# Altium schematic sheet Schematic.schdoc
size 307 x 218 mm; Symbol: Drawing-Symbol_A4; Device: Drawing-Symbol_A4; Company: 嘉立创EDA; Version: V1.0; Page Size: A4; @Project Name: 一种小巧车载实时加速度显示器; @Page Count: 1; @Update Date: 2025-10-13; @Create Date: 2025-09-15; @Schematic Name: Schematic1; @Page No: 1; @Page Name: P1; @Create Time: 08:38:36; @Update Time: 17:02:05; Width: 1170; Height: 825; Region Start: 1; X Region Count: 6; Y Region Count: 4; Blade Width: 10; Title Block Position: 3; @Board Name: Board1
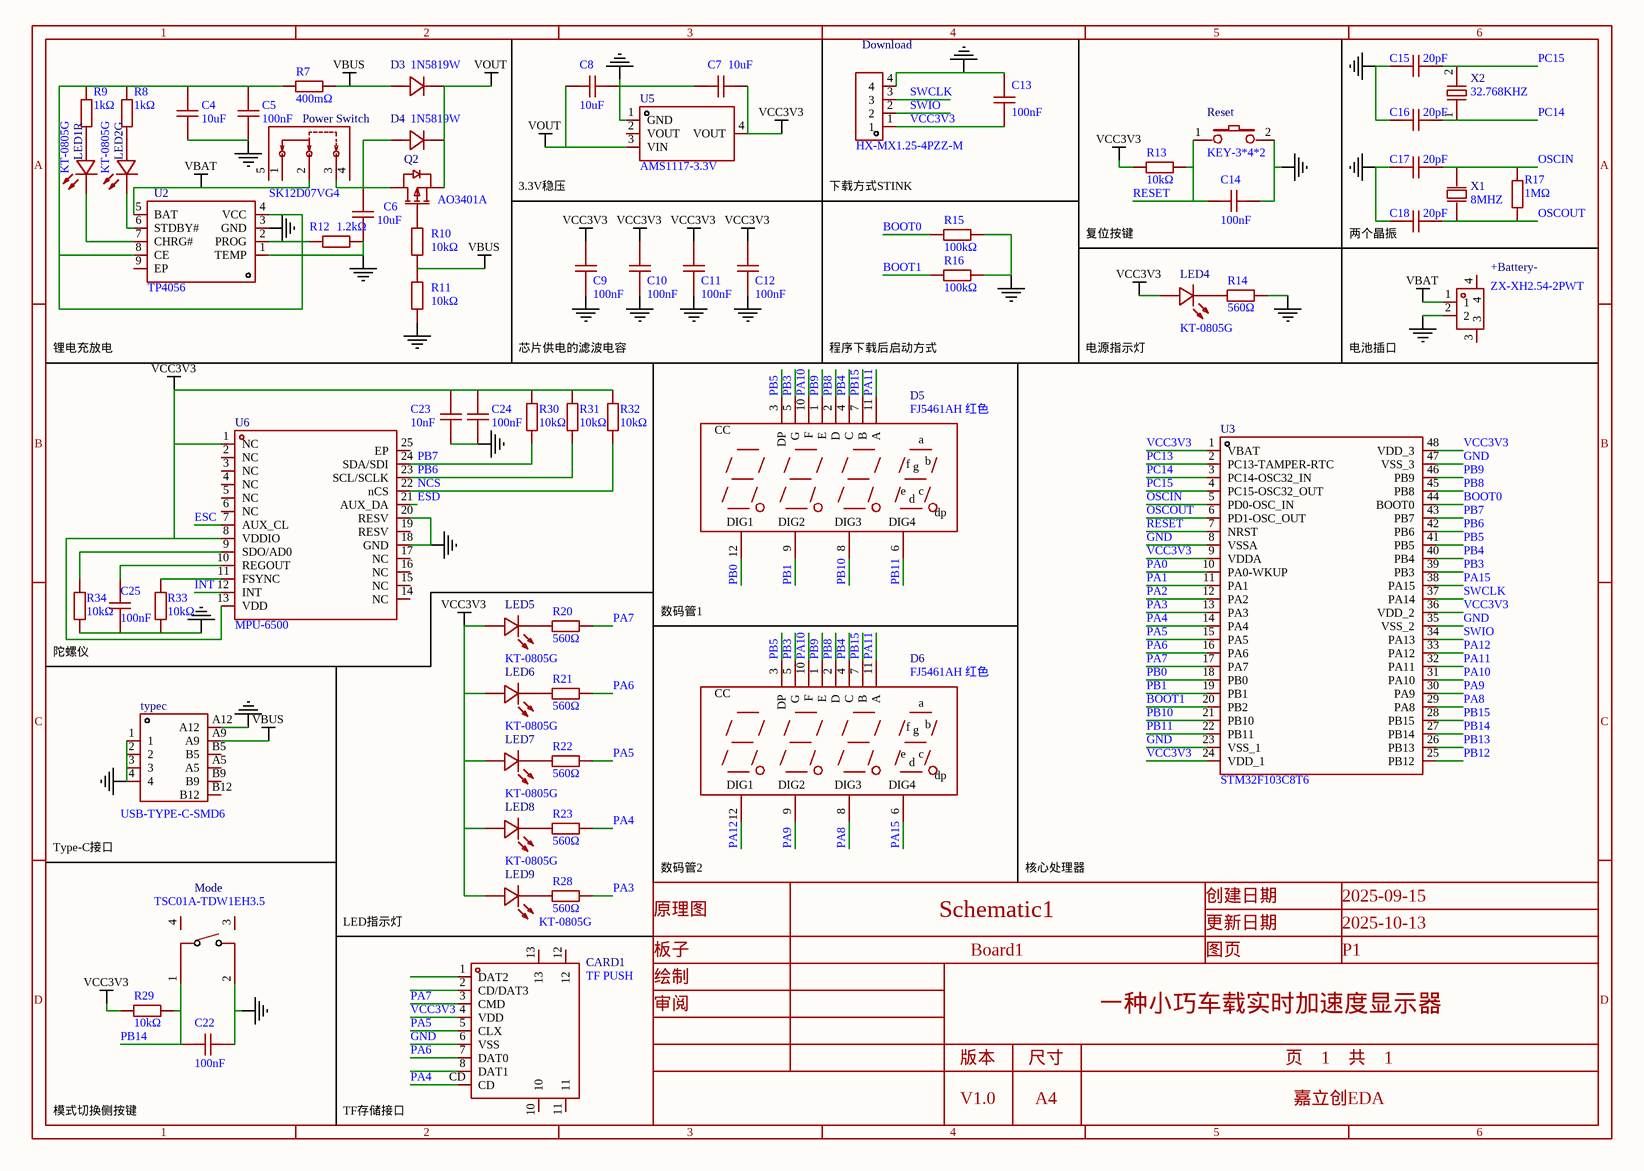
[diagram p0: Schematic.schdoc]

## Parts
+Battery-  ZX-XH2.54-2PWT  [CONN-SMD_2P-P2.54_MEGASTAR_ZX-XH2.54-2PWT]
C4  10uF  [C0603]
C5  100nF  [C0603]
C6  10uF  [C0603]
C7  10uF  [C0603]
C8  10uF  [C0603]
C9  100nF  [C0603]
C10  100nF  [C0603]
C11  100nF  [C0603]
C12  100nF  [C0603]
C13  100nF  [C0603]
C14  100nF  [C0603]
C15  20pF  [C0603]
C16  20pF  [C0603]
C17  20pF  [C0603]
C18  20pF  [C0603]
C22  100nF  [C0603]
C23  10nF  [C0603]
C24  100nF  [C0603]
C25  100nF  [C0603]
CARD1  TF PUSH  [TF-SMD_TF-PUSH]
D3  1N5819W  [SOD-123_L2.7-W1.6-LS3.7-RD]
D4  1N5819W  [SOD-123_L2.7-W1.6-LS3.7-RD]
D5  FJ5461AH 红色  [LED-SEG-TH_FJ5461AH]
D6  FJ5461AH 红色  [LED-SEG-TH_FJ5461AH]
Download  HX-MX1.25-4PZZ-M  [CONN-TH_4P-P1.25_HX-1.25MM-4P-ZZ-MS]
LED1R  KT-0805G  [LED0805-R-RD]
LED2G  KT-0805G  [LED0805-R-RD]
LED4  KT-0805G  [LED0805-R-RD]
LED5  KT-0805G  [LED0805-R-RD]
LED6  KT-0805G  [LED0805-R-RD]
LED7  KT-0805G  [LED0805-R-RD]
LED8  KT-0805G  [LED0805-R-RD]
LED9  KT-0805G  [LED0805-R-RD]
Mode  TSC01A-TDW1EH3.5  [KEY-SMD_4P-L4.6-W2.4_TSC01A-TDW1FH3.5]
Power_Switch  SK12D07VG4  [SW-TH_SK12D07VG4]
Q2  AO3401A  [SOT-23_L2.9-W1.3-P1.90-LS2.4-BR]
R7  400mΩ  [R0603]
R8  1kΩ  [R0603]
R9  1kΩ  [R0603]
R10  10kΩ  [R0603]
R11  10kΩ  [R0603]
R12  1.2kΩ  [R0603]
R13  10kΩ  [R0603]
R14  560Ω  [R0603]
R15  100kΩ  [R0603]
R16  100kΩ  [R0603]
R17  1MΩ  [R0603]
R20  560Ω  [R0603]
R21  560Ω  [R0603]
R22  560Ω  [R0603]
R23  560Ω  [R0603]
R28  560Ω  [R0603]
R29  10kΩ  [R0603]
R30  10kΩ  [R0603]
R31  10kΩ  [R0603]
R32  10kΩ  [R0603]
R33  10kΩ  [R0603]
R34  10kΩ  [R0603]
Reset  KEY-3*4*2  [SW-SMD_L4.0-W2.9-LS5.0]
typec  USB-TYPE-C-SMD6  [MICRO-USB-SMD_USB-TYPE-C-SMD6]
U2  TP4056  [ESOP-8_L4.9-W3.9-P1.27-LS6.0-BL-EP]
U3  STM32F103C8T6  [LQFP-48_L7.0-W7.0-P0.50-LS9.0-BL]
U5  AMS1117-3.3V  [SOT-223-3_L6.5-W3.4-P2.30-LS7.0-BR]
U6  MPU-6500  [QFN-24_L3.0-W3.0-P0.40-BL-EP]
X1  8MHZ  [HC-49S_L11.5-W5.0-P4.88]
X2  32.768KHZ  [CRYSTAL-SMD_L3.2-W1.5-1]

## Nets
GND: +Battery-.2 C4.1 C5.1 C6.1 C7.1 C8.2 C9.1 C10.1 C11.1 C12.1 C13.2 C14.2 C15.1 C16.1 C17.1 C18.1 C22.2 C23.1 C24.1 C25.1 CARD1.6(VSS) Download.4 Mode.2 R11.1 R12.2 R14.2 R15.2 R16.2 R33.1 R34.1 Reset.2 typec.1 typec.2 typec.3 typec.4 typec.A12 U2.1(TEMP) U2.3(GND) U3.8(VSSA) U3.23(VSS_1) U3.35(VSS_2) U3.47(VSS_3) U5.1(GND) U6.18(GND) U6.20(RESV)
VBAT: +Battery-.1 Power_Switch.2 U2.5(BAT)
VBUS: D3.2(A) R7.2 R10.1 R11.2 typec.A9
VCC3V3: C7.2 C9.2 C10.2 C11.2 C12.2 C13.1 C23.2 C24.2 CARD1.4(VDD) Download.1 LED4.1(A) LED5.1(A) LED6.1(A) LED7.1(A) LED8.1(A) LED9.1(A) R13.1 R29.1 R30.2 R31.2 R32.2 U3.1(VBAT) U3.9(VDDA) U3.24(VDD_1) U3.36(VDD_2) U3.48(VDD_3) U5.4(VOUT) U6.1(NC) U6.8(VDDIO) U6.13(VDD)
VOUT: C8.1 D3.1(K) D4.1(K) Q2.2(S) U5.3(VIN)
BOOT0: R15.1 U3.44(BOOT0)
BOOT1: R16.1 U3.20(PB2)
ESC: U6.7(AUX_CL)
ESD: U6.21(AUX_DA)
INT: U6.12(INT)
NCS: R32.1 U6.22(nCS)
OSCIN: C17.2 R17.2 U3.5(PD0-OSC_IN) X1.2(OSC2)
OSCOUT: C18.2 R17.1 U3.6(PD1-OSC_OUT) X1.1(OSC1)
PA0: U3.10(PA0-WKUP)
PA1: U3.11(PA1)
PA2: U3.12(PA2)
PA3: R28.2 U3.13(PA3)
PA4: CARD1.CD R23.2 U3.14(PA4)
PA5: CARD1.5(CLX) R22.2 U3.15(PA5)
PA6: CARD1.7(DAT0) R21.2 U3.16(PA6)
PA7: CARD1.3(CMD) R20.2 U3.17(PA7)
PA8: D6.8(DIG3) U3.29(PA8)
PA9: D6.9(DIG2) U3.30(PA9)
PA10: D5.10(F) D6.10(F) U3.31(PA10)
PA11: D5.11(A) D6.11(A) U3.32(PA11)
PA12: D6.12(DIG1) U3.33(PA12)
PA15: D6.6(DIG4) U3.38(PA15)
PB0: D5.12(DIG1) U3.18(PB0)
PB1: D5.9(DIG2) U3.19(PB1)
PB3: D5.5(G) D6.5(G) U3.39(PB3)
PB4: D5.4(C) D6.4(C) U3.40(PB4)
PB5: D5.3(DP) D6.3(DP) U3.41(PB5)
PB6: R31.1 U3.42(PB6) U6.23(SCL/SCLK)
PB7: R30.1 U3.43(PB7) U6.24(SDA/SDI)
PB8: D5.2(D) D6.2(D) U3.45(PB8)
PB9: D5.1(E) D6.1(E) U3.46(PB9)
PB10: D5.8(DIG3) U3.21(PB10)
PB11: D5.6(DIG4) U3.22(PB11)
PB12: U3.25(PB12)
PB13: U3.26(PB13)
PB14: C22.1 Mode.1 R29.2 U3.27(PB14)
PB15: D5.7(B) D6.7(B) U3.28(PB15)
PC13: U3.2(PC13-TAMPER-RTC)
PC14: C16.2 U3.3(PC14-OSC32_IN) X2.1
PC15: C15.2 U3.4(PC15-OSC32_OUT) X2.2
RESET: C14.1 R13.2 Reset.1 U3.7(NRST)
SWCLK: Download.3 U3.37(PA14)
SWIO: Download.2 U3.34(PA13)
NetC4_2: C4.2 C5.2 R7.1 R8.2 R9.2 U2.4(VCC) U2.8(CE)
NetC6_2: C6.2 D4.2(A) Power_Switch.3 Q2.3(D)
NetC25_2: C25.2 U6.10(REGOUT)
NetLED1R_1: LED1R.1(A) R9.1
NetLED1R_2: LED1R.2(K) U2.7(CHRG#)
NetLED2G_1: LED2G.1(A) R8.1
NetLED2G_2: LED2G.2(K) U2.6(STDBY#)
NetLED4_2: LED4.2(K) R14.1
NetLED5_2: LED5.2(K) R20.1
NetLED6_2: LED6.2(K) R21.1
NetLED7_2: LED7.2(K) R22.1
NetLED8_2: LED8.2(K) R23.1
NetLED9_2: LED9.2(K) R28.1
NetQ2_1: Q2.1(G) R10.2
NetR12_1: R12.1 U2.2(PROG)
NetR33_2: R33.2 U6.11(FSYNC)
NetR34_2: R34.2 U6.9(SDO/AD0)

Not connected (* = marked no-connect by the designer): +Battery- 3 4; CARD1 1(DAT2) 2(CD/DAT3) 8(DAT1) 10 11 12 13; Mode 3 4; Power_Switch 1 4 5; typec A5 B5 B9 B12; U2 9(EP); U5 2(VOUT); U6 2(NC) 3(NC) 4(NC) 5(NC) 6(NC) 14(NC) 15(NC) 16(NC) 17(NC) 19(RESV) 25(EP)

## Notes on the sheet
- 3.3V稳压
- 下载方式STINK
- 复位按键
- (near C18) 两个晶振
- 锂电充放电
- 芯片供电的滤波电容
- 程序下载后启动方式
- 电源指示灯
- 电池插口
- (near R34) 陀螺仪
- 数码管1
- Type-C接口
- LED指示灯
- 数码管2
- 核心处理器
- 模式切换侧按键
- TF存储接口
- 1
- 2
- 3
- 4
- 5
- 6
- A
- B
- C
- 原理图
- Schematic1
- 创建日期
- 更新日期
- 2025-09-15
- 2025-10-13
- 板子
- 绘制
- Board1
- 图页
- P1
- D
- 审阅
- 版本
- 尺寸
- 一种小巧车载实时加速度显示器
- 页    1    共    1
- V1.0
- A4
- 嘉立创EDA
- (in symbol FJ5461AH 红色) CC; a; f; b; g; e; c; d; dp

## Library data of the parts
+Battery- = ZX-XH2.54-2PWT: Manufacturer: Megastar(兆星); Add into BOM: yes; Pins Structure: 1x2P; Pitch: 2.5mm; Reference Series: XH; Number of PINs Per Row: 2; Current Rating: 3A; Voltage Rating: 250V; Supplementary Features: 辅助焊脚; Z-Height of the Board: 6.2mm; X-Length of Bottom Edge on Board (Spacing Line): 10mm; Y-Width of Bottom Edge on Board: 10.5mm; Symbol: ZX-XH2.54-2PWT; Device: ZX-XH2.54-2PWT; LCSC Part Name: 1x2P 间距:2.5mm 卧贴 系列:XH; Supplier Part: C7429671; Manufacturer Part: ZX-XH2.54-2PWT; Supplier Footprint: SMD,P=2.5mm,卧贴; JLCPCB Part Class: 扩展库; Datasheet: https://item.szlcsc.com/datasheet/ZX-XH2.54-2PWT/8427588.html; Supplier: LCSC; Convert to PCB: yes; Mounting Type: 卧贴; Number of Pins: 2P; Number of Rows: 1; Row Spacing: -; Contact Material: 黄铜; Contact Plating: 锡; Operating Temperature: -25℃~+85℃; Plastic Material: -; Flame Retardant Rating: -; Color: 米色
C4 = CGA0603X5R106K100JT: Manufacturer: HRE(芯声); Symbol: Capacitance; Add into BOM: yes; Tolerance: ±10%; Voltage Rating: 10V; Temperature Coefficient: X5R; Channel ID: $1e1874; Device: CGA0603X5R106K100JT; LCSC Part Name: 10uF ±10% 10V; Supplier Part: C6119842; Manufacturer Part: CGA0603X5R106K100JT; Supplier Footprint: 0603; JLCPCB Part Class: Extended Part; Supplier: LCSC; Convert to PCB: yes; Value: 10uF; FootprintName: C0603; DeviceName: CGA0603X5R106K100JT
C5 C9-C14 C22 C24 C25 = CGA0603X7R104K500JT: Manufacturer: HRE(芯声); Symbol: Capacitance; Add into BOM: yes; Tolerance: ±10%; Voltage Rating: 50V; Temperature Coefficient: X7R; Device: CGA0603X7R104K500JT; LCSC Part Name: 100nF ±10% 50V; Supplier Part: C6119867; Manufacturer Part: CGA0603X7R104K500JT; Supplier Footprint: 0603; JLCPCB Part Class: Extended Part; Datasheet: https://atta.szlcsc.com/upload/public/pdf/source/20250103/C44077DA9E7B3EFAE02F22B6D3D1CBC9.pdf; Supplier: LCSC; Convert to PCB: yes; Value: 100nF
C6 = CGA0603X5R106K100JT: Manufacturer: HRE(芯声); Symbol: Capacitance; Add into BOM: yes; Tolerance: ±10%; Voltage Rating: 10V; Temperature Coefficient: X5R; Channel ID: $1e1609; Device: CGA0603X5R106K100JT; LCSC Part Name: 10uF ±10% 10V; Supplier Part: C6119842; Manufacturer Part: CGA0603X5R106K100JT; Supplier Footprint: 0603; JLCPCB Part Class: Extended Part; Supplier: LCSC; Convert to PCB: yes; Value: 10uF; FootprintName: C0603; DeviceName: CGA0603X5R106K100JT
C7 = CGA0603X5R106K100JT: Manufacturer: HRE(芯声); Symbol: Capacitance; Add into BOM: yes; Tolerance: ±10%; Voltage Rating: 10V; Temperature Coefficient: X5R; Channel ID: $1e4183; Device: CGA0603X5R106K100JT; LCSC Part Name: 10uF ±10% 10V; Supplier Part: C6119842; Manufacturer Part: CGA0603X5R106K100JT; Supplier Footprint: 0603; JLCPCB Part Class: Extended Part; Supplier: LCSC; Convert to PCB: yes; Value: 10uF; FootprintName: C0603; DeviceName: CGA0603X5R106K100JT
C8 = CGA0603X5R106K100JT: Manufacturer: HRE(芯声); Symbol: Capacitance; Add into BOM: yes; Tolerance: ±10%; Voltage Rating: 10V; Temperature Coefficient: X5R; Channel ID: $1e4207; Device: CGA0603X5R106K100JT; LCSC Part Name: 10uF ±10% 10V; Supplier Part: C6119842; Manufacturer Part: CGA0603X5R106K100JT; Supplier Footprint: 0603; JLCPCB Part Class: Extended Part; Supplier: LCSC; Convert to PCB: yes; Value: 10uF; FootprintName: C0603; DeviceName: CGA0603X5R106K100JT
C15 = CC0603JRNPO9BN200: Manufacturer: YAGEO(国巨); Symbol: Capacitance; Add into BOM: yes; Tolerance: ±5%; Voltage Rated: 50V; Temperature Coefficient: NP0; Channel ID: $1e6253; Device: CC0603JRNPO9BN200; LCSC Part Name: 20pF ±5% 50V; Supplier Part: C105621; Manufacturer Part: CC0603JRNPO9BN200; Supplier Footprint: 0603; JLCPCB Part Class: Extended Part; Datasheet: https://atta.szlcsc.com/upload/public/pdf/source/20170505/1493957838062.pdf; Supplier: LCSC; Convert to PCB: yes; Value: 20pF; FootprintName: C0603; DeviceName: CC0603JRNPO9BN200
C16 = CC0603JRNPO9BN200: Manufacturer: YAGEO(国巨); Symbol: Capacitance; Add into BOM: yes; Tolerance: ±5%; Voltage Rated: 50V; Temperature Coefficient: NP0; Channel ID: $1e6277; Device: CC0603JRNPO9BN200; LCSC Part Name: 20pF ±5% 50V; Supplier Part: C105621; Manufacturer Part: CC0603JRNPO9BN200; Supplier Footprint: 0603; JLCPCB Part Class: Extended Part; Datasheet: https://atta.szlcsc.com/upload/public/pdf/source/20170505/1493957838062.pdf; Supplier: LCSC; Convert to PCB: yes; Value: 20pF; FootprintName: C0603; DeviceName: CC0603JRNPO9BN200
C17 = CC0603JRNPO9BN200: Manufacturer: YAGEO(国巨); Symbol: Capacitance; Add into BOM: yes; Tolerance: ±5%; Voltage Rated: 50V; Temperature Coefficient: NP0; Channel ID: $1e6574; Device: CC0603JRNPO9BN200; LCSC Part Name: 20pF ±5% 50V; Supplier Part: C105621; Manufacturer Part: CC0603JRNPO9BN200; Supplier Footprint: 0603; JLCPCB Part Class: Extended Part; Datasheet: https://atta.szlcsc.com/upload/public/pdf/source/20170505/1493957838062.pdf; Supplier: LCSC; Convert to PCB: yes; Value: 20pF; FootprintName: C0603; DeviceName: CC0603JRNPO9BN200
C18 = CC0603JRNPO9BN200: Manufacturer: YAGEO(国巨); Symbol: Capacitance; Add into BOM: yes; Tolerance: ±5%; Voltage Rated: 50V; Temperature Coefficient: NP0; Channel ID: $1e6628; Device: CC0603JRNPO9BN200; LCSC Part Name: 20pF ±5% 50V; Supplier Part: C105621; Manufacturer Part: CC0603JRNPO9BN200; Supplier Footprint: 0603; JLCPCB Part Class: Extended Part; Datasheet: https://atta.szlcsc.com/upload/public/pdf/source/20170505/1493957838062.pdf; Supplier: LCSC; Convert to PCB: yes; Value: 20pF; FootprintName: C0603; DeviceName: CC0603JRNPO9BN200
C23 = CGA0603X7R103K500JT: Manufacturer: HRE(芯声); Symbol: Capacitance; Add into BOM: yes; Tolerance: ±10%; Voltage Rating: 50V; Temperature Coefficient: X7R; Channel ID: $1e29061; Device: CGA0603X7R103K500JT; LCSC Part Name: 10nF ±10% 50V; Supplier Part: C7503504; Manufacturer Part: CGA0603X7R103K500JT; Supplier Footprint: 0603; JLCPCB Part Class: Extended Part; Supplier: LCSC; Convert to PCB: yes; Value: 10nF; FootprintName: C0603; DeviceName: CGA0603X7R103K500JT
CARD1 = TF PUSH: Manufacturer: SHOU HAN(首韩); Add into BOM: yes; Card Connection Mode: 自弹式; Card Type: MicroSD卡(TF卡); Connector Type: 卡座; Additional Card Detection Pins: 无; Symbol: TF PUSH; Device: TF PUSH; LCSC Part Name: 自弹式 MicroSD卡(TF卡) 卡座; Supplier Part: C393941; Manufacturer Part: TF PUSH; Supplier Footprint: SMD; JLCPCB Part Class: 扩展库; Datasheet: https://item.szlcsc.com/datasheet/TF%2520PUSH/372553.html; Supplier: LCSC; Convert to PCB: yes; Supplementary Features: -; Height Above Board: 2mm; Operating Temperature: -25℃~+90℃
D3 = 1N5819W_C5451628: Manufacturer: HXY MOSFET(华轩阳电子); Symbol: 1N4007_C9900004759; Add into BOM: yes; Diode Configuration: 独立式; Voltage - Forward(Vf@If): 600mV@200mA; Voltage - DC Reverse(Vr): 40V; Current - Rectified: 350mA; Reverse Leakage Current (Ir): 5uA@30V; Channel ID: $1e1657; Device: 1N5819W_C5451628; LCSC Part Name: 电压:40V 电流:350mA; Supplier Part: C5451628; Manufacturer Part: 1N5819W; Supplier Footprint: SOD-123; JLCPCB Part Class: Extended Part; Datasheet: https://item.szlcsc.com/datasheet/1N5819W/6355371.html; Supplier: LCSC; Convert to PCB: yes; FootprintName: SOD-123_L2.7-W1.6-LS3.7-RD; DeviceName: 1N5819W_C5451628
D4 = 1N5819W_C5451628: Manufacturer: HXY MOSFET(华轩阳电子); Symbol: 1N4007_C9900004759; Add into BOM: yes; Diode Configuration: 独立式; Voltage - Forward(Vf@If): 600mV@200mA; Voltage - DC Reverse(Vr): 40V; Current - Rectified: 350mA; Reverse Leakage Current (Ir): 5uA@30V; Channel ID: $1e1687; Device: 1N5819W_C5451628; LCSC Part Name: 电压:40V 电流:350mA; Supplier Part: C5451628; Manufacturer Part: 1N5819W; Supplier Footprint: SOD-123; JLCPCB Part Class: Extended Part; Datasheet: https://item.szlcsc.com/datasheet/1N5819W/6355371.html; Supplier: LCSC; Convert to PCB: yes; FootprintName: SOD-123_L2.7-W1.6-LS3.7-RD; DeviceName: 1N5819W_C5451628
D5 D6 = FJ5461AH 红色: Manufacturer: 志浩; Symbol: FJ5461AH red; Add into BOM: yes; Number of Characters: 4位; Display Type: 7段; LED Polarity: 共阴极; Digit/Alpha Size(inch): 0.56; Device: FJ5461AH 红色; LCSC Part Name: 4位0.56英寸红色数码管 共阴极; Supplier Part: C54396; Manufacturer Part: FJ5461AH 红色; Supplier Footprint: 插件; JLCPCB Part Class: 扩展库; Datasheet: https://atta.szlcsc.com/upload/public/pdf/source/20151111/1457707576636.pdf; Supplier: LCSC; Convert to PCB: yes; Module Size: -; Power Dissipation: -; Luminous Color: 红色
Download = HX-MX1.25-4PZZ-M: Manufacturer: hanxia(韩下); Add into BOM: yes; Pins Structure: 1x4P; Pitch: 1.25mm; Number of PINs Per Row: 4; Current Rating: 1A; Voltage Rating: 125V; Plastic Material: PA6T; Flame Retardant Rating: UL94V-0; Symbol: HX-MX1.25-4PZZ-M; Device: HX-MX1.25-4PZZ-M; LCSC Part Name: 1x4P 间距:1.25mm 直插; Supplier Part: C48641609; Manufacturer Part: HX-MX1.25-4PZZ-M; Supplier Footprint: 插件,P=1.25mm; JLCPCB Part Class: 扩展库; Datasheet: https://item.szlcsc.com/datasheet/HX-MX1.25-4PZZ-M/50919855.html; Supplier: LCSC; Convert to PCB: yes; Mounting Type: 直插; Reference Series: -; Number of Pins: 4P; Number of Rows: 1; Row Spacing: -; Contact Material: 黄铜; Contact Plating: 锡; Operating Temperature: -25℃~+85℃; Supplementary Features: -; Color: 米色
LED1R LED2G LED4-LED9 = KT-0805G: Manufacturer: KENTO; Symbol: 0805G (Green); Add into BOM: yes; Illumination Color: 翠绿色; Voltage - Forward(Vf): 2.6V~3.1V; Power(Watts): 100mW; Forward Current: 5mA; Wavelength - Dominant: 513nm~528nm; Peak Wavelength: 525nm; Luminous Intensity: 430mcd; Viewing Angle: 120°; Device: KT-0805G; LCSC Part Name: 0805 翠绿 高亮; Supplier Part: C2297; Manufacturer Part: KT-0805G; Supplier Footprint: 0805; JLCPCB Part Class: 基础库; Datasheet: https://item.szlcsc.com/datasheet/KT-0805G/2670.html; Supplier: LCSC; Convert to PCB: yes; Lamp Holder Type: -; Diode Configuration: -; Lens Color: -; Color Temperature: -; Mounting Style: -; Operating Temperature: -40℃~+85℃
Mode = TSC01A-TDW1EH3.5: Manufacturer: XYECONN(辛译); Add into BOM: yes; Circuit: 单刀单掷; Actuator Style: 矩形按钮; Operating Force: 1.8N; Switch Height: 3.5mm; Contact Current: 50mA; Voltage Rating: 12V; Symbol: TSC01A-TDW1EH3.5; Device: TSC01A-TDW1EH3.5; LCSC Part Name: 2*4*3.5 卧贴 180GF 带定位柱 侧按轻触开关; Supplier Part: C22362980; Manufacturer Part: TSC01A-TDW1EH3.5; Supplier Footprint: SMD-4P,4.8x2mm; JLCPCB Part Class: 扩展库; Datasheet: https://item.szlcsc.com/datasheet/TSC01A-TDW1EH3.5/23811828.html; Supplier: LCSC; Convert to PCB: yes; Mounting Type: 卧贴
Power_Switch = SK12D07VG4: Manufacturer: SHOU HAN(首韩); Add into BOM: yes; Circuit: 单刀双掷; Actuator Style: 矩形柱状; Switch Height: 8.8mm; Current Rating: 500mA; Voltage Rating: 50V; Life: 5千次; Channel ID: $1e20535; Symbol: SK12D07VG4; Device: SK12D07VG4; LCSC Part Name: 3脚2档位 卧插 滑动开关; Supplier Part: C393937; Manufacturer Part: SK12D07VG4; Supplier Footprint: 插件; JLCPCB Part Class: 扩展库; Datasheet: https://item.szlcsc.com/datasheet/SK12D07VG4/372549.html; Supplier: LCSC; Convert to PCB: yes; Termination Style: PC引脚; Mounting Type: -; Operating Temperature: -; Length: 8.7mm; FootprintName: SW-TH_SK12D07VG4; DeviceName: SK12D07VG4
Q2 = AO3401A_C347476: Manufacturer: UMW(友台半导体); Add into BOM: yes; Number: 1个P沟道; Drain to Source Voltage: 30V; Current - Continuous Drain(Id): 4.2A; RDS(on): 50mΩ@10V; Pd - Power Dissipation: 1.4W; Gate Threshold Voltage (Vgs(th)): 1.3V@250uA; Gate Charge(Qg): 9.4nC@4.5V; Input Capacitance(Ciss): 954pF; Reverse Transfer Capacitance (Crss@Vds): 77pF; Type: P沟道; Output Capacitance(Coss): 115pF; Symbol: AO3401A_C347476; Device: AO3401A_C347476; LCSC Part Name: 1个P沟道 耐压:30V 电流:4.2A; Supplier Part: C347476; Manufacturer Part: AO3401A; Supplier Footprint: SOT-23; JLCPCB Part Class: 扩展库; Datasheet: https://item.szlcsc.com/datasheet/AO3401A/324136.html; Supplier: LCSC; Convert to PCB: yes; Operating Temperature: -55℃~+150℃
R7 = FRL0603JR400TS: Manufacturer: FOJAN(富捷); Symbol: 电阻; Add into BOM: yes; Tolerance: ±5%; Power(Watts): 100mW; Voltage-Supply(Max): 100V; Temperature Coefficient: ±300ppm/℃; Channel ID: $1e1550; Device: FRL0603JR400TS; LCSC Part Name: 400mΩ ±5% 100mW 厚膜电阻; Supplier Part: C5126106; Manufacturer Part: FRL0603JR400TS; Supplier Footprint: 0603; JLCPCB Part Class: Extended Part; Supplier: LCSC; Convert to PCB: yes; Type: 厚膜电阻; Value: 400mΩ; Operating Temperature: -55℃~+155℃; FootprintName: R0603; DeviceName: FRL0603JR400TS
R8 = FRC0603F1001TS: Manufacturer: FOJAN(富捷); Symbol: 电阻; Add into BOM: yes; Tolerance: ±1%; Power(Watts): 100mW; Voltage-Supply(Max): 75V; Temperature Coefficient: ±100ppm/℃; Channel ID: $1e1944; Device: FRC0603F1001TS; LCSC Part Name: 1kΩ ±1% 100mW 厚膜电阻; Supplier Part: C2907002; Manufacturer Part: FRC0603F1001TS; Supplier Footprint: 0603; JLCPCB Part Class: Extended Part; Supplier: LCSC; Convert to PCB: yes; Type: 厚膜电阻; Value: 1kΩ; Operating Temperature: -55℃~+155℃; Overload Voltage (Max): 75V; FootprintName: R0603; DeviceName: FRC0603F1001TS
R9 = FRC0603F1001TS: Manufacturer: FOJAN(富捷); Symbol: 电阻; Add into BOM: yes; Tolerance: ±1%; Power(Watts): 100mW; Voltage-Supply(Max): 75V; Temperature Coefficient: ±100ppm/℃; Channel ID: $1e1968; Device: FRC0603F1001TS; LCSC Part Name: 1kΩ ±1% 100mW 厚膜电阻; Supplier Part: C2907002; Manufacturer Part: FRC0603F1001TS; Supplier Footprint: 0603; JLCPCB Part Class: Extended Part; Supplier: LCSC; Convert to PCB: yes; Type: 厚膜电阻; Value: 1kΩ; Operating Temperature: -55℃~+155℃; Overload Voltage (Max): 75V; FootprintName: R0603; DeviceName: FRC0603F1001TS
R10 = RCA0310KJLF: Manufacturer: HKR(香港电阻); Symbol: 电阻; Add into BOM: yes; Tolerance: ±5%; Power(Watts): 100mW; Channel ID: $1e1784; Voltage-Supply(Max): 75V; Temperature Coefficient: ±100ppm/℃; Device: RCA0310KJLF; LCSC Part Name: 10kΩ ±5% 100mW; Supplier Part: C22369937; Manufacturer Part: RCA0310KJLF; Supplier Footprint: 0603; JLCPCB Part Class: Extended Part; Datasheet: https://item.szlcsc.com/datasheet/RCA0310KJLF/23848968.html; Supplier: LCSC; Convert to PCB: yes; Value: 10kΩ; Type: 厚膜电阻; FootprintName: R0603; DeviceName: RCA0310KJLF
R11 = RCA0310KJLF: Manufacturer: HKR(香港电阻); Symbol: 电阻; Add into BOM: yes; Tolerance: ±5%; Power(Watts): 100mW; Channel ID: $1e1822; Voltage-Supply(Max): 75V; Temperature Coefficient: ±100ppm/℃; Device: RCA0310KJLF; LCSC Part Name: 10kΩ ±5% 100mW; Supplier Part: C22369937; Manufacturer Part: RCA0310KJLF; Supplier Footprint: 0603; JLCPCB Part Class: Extended Part; Datasheet: https://item.szlcsc.com/datasheet/RCA0310KJLF/23848968.html; Supplier: LCSC; Convert to PCB: yes; Value: 10kΩ; Type: 厚膜电阻; FootprintName: R0603; DeviceName: RCA0310KJLF
R12 = FRC0603J122 TS: Manufacturer: FOJAN(富捷); Symbol: 电阻; Add into BOM: yes; Tolerance: ±5%; Power(Watts): 100mW; Voltage-Supply(Max): 75V; Temperature Coefficient: ±100ppm/℃; Channel ID: $1e1633; Device: FRC0603J122 TS; LCSC Part Name: 1.2kΩ ±5% 100mW 厚膜电阻; Supplier Part: C2907081; Manufacturer Part: FRC0603J122 TS; Supplier Footprint: 0603; JLCPCB Part Class: Extended Part; Supplier: LCSC; Convert to PCB: yes; Type: 厚膜电阻; Value: 1.2kΩ; Operating Temperature: -55℃~+155℃; FootprintName: R0603; DeviceName: FRC0603J122 TS
R13 R29 = RCA0310KJLF: Manufacturer: HKR(香港电阻); Symbol: 电阻; Add into BOM: yes; Tolerance: ±5%; Power(Watts): 100mW; Channel ID: $1e5524; Voltage-Supply(Max): 75V; Temperature Coefficient: ±100ppm/℃; Device: RCA0310KJLF; LCSC Part Name: 10kΩ ±5% 100mW; Supplier Part: C22369937; Manufacturer Part: RCA0310KJLF; Supplier Footprint: 0603; JLCPCB Part Class: Extended Part; Datasheet: https://item.szlcsc.com/datasheet/RCA0310KJLF/23848968.html; Supplier: LCSC; Convert to PCB: yes; Value: 10kΩ; Type: 厚膜电阻; FootprintName: R0603; DeviceName: RCA0310KJLF
R14 = FRC0603F5600TS: Manufacturer: FOJAN(富捷); Symbol: 电阻; Add into BOM: yes; Tolerance: ±1%; Power(Watts): 100mW; Voltage-Supply(Max): 75V; Temperature Coefficient: ±100ppm/℃; Device: FRC0603F5600TS; LCSC Part Name: 560Ω ±1% 100mW 厚膜电阻; Supplier Part: C2907052; Manufacturer Part: FRC0603F5600TS; Supplier Footprint: 0603; JLCPCB Part Class: Extended Part; Supplier: LCSC; Convert to PCB: yes; Type: 厚膜电阻; Value: 560Ω; Operating Temperature: -55℃~+155℃
R15 = RCA03100KJLF: Manufacturer: HKR(香港电阻); Symbol: 电阻; Add into BOM: yes; Tolerance: ±5%; Power(Watts): 100mW; Voltage-Supply(Max): 75V; Temperature Coefficient: ±100ppm/℃; Channel ID: $1e6002; Device: RCA03100KJLF; LCSC Part Name: 100kΩ ±5% 100mW; Supplier Part: C22356636; Manufacturer Part: RCA03100KJLF; Supplier Footprint: 0603; JLCPCB Part Class: Extended Part; Datasheet: https://item.szlcsc.com/datasheet/RCA03100KJLF/23790080.html; Supplier: LCSC; Convert to PCB: yes; Type: 厚膜电阻; Value: 100kΩ; Operating Temperature: -55℃~+155℃; FootprintName: R0603; DeviceName: RCA03100KJLF
R16 = RCA03100KJLF: Manufacturer: HKR(香港电阻); Symbol: 电阻; Add into BOM: yes; Tolerance: ±5%; Power(Watts): 100mW; Voltage-Supply(Max): 75V; Temperature Coefficient: ±100ppm/℃; Channel ID: $1e6026; Device: RCA03100KJLF; LCSC Part Name: 100kΩ ±5% 100mW; Supplier Part: C22356636; Manufacturer Part: RCA03100KJLF; Supplier Footprint: 0603; JLCPCB Part Class: Extended Part; Datasheet: https://item.szlcsc.com/datasheet/RCA03100KJLF/23790080.html; Supplier: LCSC; Convert to PCB: yes; Type: 厚膜电阻; Value: 100kΩ; Operating Temperature: -55℃~+155℃; FootprintName: R0603; DeviceName: RCA03100KJLF
R17 = FRC0603J105 TS: Manufacturer: FOJAN(富捷); Symbol: 电阻; Add into BOM: yes; Tolerance: ±5%; Power(Watts): 100mW; Voltage-Supply(Max): 75V; Temperature Coefficient: ±100ppm/℃; Channel ID: $1e6667; Device: FRC0603J105 TS; LCSC Part Name: 1MΩ ±5% 100mW 厚膜电阻; Supplier Part: C2907115; Manufacturer Part: FRC0603J105 TS; Supplier Footprint: 0603; JLCPCB Part Class: Extended Part; Supplier: LCSC; Convert to PCB: yes; Type: 厚膜电阻; Value: 1MΩ; Operating Temperature: -55℃~+155℃; Overload Voltage (Max): 75V; FootprintName: R0603; DeviceName: FRC0603J105 TS
R20 = FRC0603F5600TS: Manufacturer: FOJAN(富捷); Symbol: 电阻; Add into BOM: yes; Tolerance: ±1%; Power(Watts): 100mW; Voltage-Supply(Max): 75V; Temperature Coefficient: ±100ppm/℃; Channel ID: $1e8952; Device: FRC0603F5600TS; LCSC Part Name: 560Ω ±1% 100mW 厚膜电阻; Supplier Part: C2907052; Manufacturer Part: FRC0603F5600TS; Supplier Footprint: 0603; JLCPCB Part Class: Extended Part; Supplier: LCSC; Convert to PCB: yes; Type: 厚膜电阻; Value: 560Ω; Operating Temperature: -55℃~+155℃; FootprintName: R0603; DeviceName: FRC0603F5600TS
R21 = FRC0603F5600TS: Manufacturer: FOJAN(富捷); Symbol: 电阻; Add into BOM: yes; Tolerance: ±1%; Power(Watts): 100mW; Voltage-Supply(Max): 75V; Temperature Coefficient: ±100ppm/℃; Channel ID: $1e9226; Device: FRC0603F5600TS; LCSC Part Name: 560Ω ±1% 100mW 厚膜电阻; Supplier Part: C2907052; Manufacturer Part: FRC0603F5600TS; Supplier Footprint: 0603; JLCPCB Part Class: Extended Part; Supplier: LCSC; Convert to PCB: yes; Type: 厚膜电阻; Value: 560Ω; Operating Temperature: -55℃~+155℃; FootprintName: R0603; DeviceName: FRC0603F5600TS
R22 = FRC0603F5600TS: Manufacturer: FOJAN(富捷); Symbol: 电阻; Add into BOM: yes; Tolerance: ±1%; Power(Watts): 100mW; Voltage-Supply(Max): 75V; Temperature Coefficient: ±100ppm/℃; Channel ID: $1e9200; Device: FRC0603F5600TS; LCSC Part Name: 560Ω ±1% 100mW 厚膜电阻; Supplier Part: C2907052; Manufacturer Part: FRC0603F5600TS; Supplier Footprint: 0603; JLCPCB Part Class: Extended Part; Supplier: LCSC; Convert to PCB: yes; Type: 厚膜电阻; Value: 560Ω; Operating Temperature: -55℃~+155℃; FootprintName: R0603; DeviceName: FRC0603F5600TS
R23 = FRC0603F5600TS: Manufacturer: FOJAN(富捷); Symbol: 电阻; Add into BOM: yes; Tolerance: ±1%; Power(Watts): 100mW; Voltage-Supply(Max): 75V; Temperature Coefficient: ±100ppm/℃; Channel ID: $1e9252; Device: FRC0603F5600TS; LCSC Part Name: 560Ω ±1% 100mW 厚膜电阻; Supplier Part: C2907052; Manufacturer Part: FRC0603F5600TS; Supplier Footprint: 0603; JLCPCB Part Class: Extended Part; Supplier: LCSC; Convert to PCB: yes; Type: 厚膜电阻; Value: 560Ω; Operating Temperature: -55℃~+155℃; FootprintName: R0603; DeviceName: FRC0603F5600TS
R28 = FRC0603F5600TS: Manufacturer: FOJAN(富捷); Symbol: 电阻; Add into BOM: yes; Tolerance: ±1%; Power(Watts): 100mW; Voltage-Supply(Max): 75V; Temperature Coefficient: ±100ppm/℃; Channel ID: $1e18229; Device: FRC0603F5600TS; LCSC Part Name: 560Ω ±1% 100mW 厚膜电阻; Supplier Part: C2907052; Manufacturer Part: FRC0603F5600TS; Supplier Footprint: 0603; JLCPCB Part Class: Extended Part; Supplier: LCSC; Convert to PCB: yes; Type: 厚膜电阻; Value: 560Ω; Operating Temperature: -55℃~+155℃; FootprintName: R0603; DeviceName: FRC0603F5600TS
R30 = RCA0310KJLF: Manufacturer: HKR(香港电阻); Symbol: 电阻; Add into BOM: yes; Tolerance: ±5%; Power(Watts): 100mW; Channel ID: $1e29242; Voltage-Supply(Max): 75V; Temperature Coefficient: ±100ppm/℃; Device: RCA0310KJLF; LCSC Part Name: 10kΩ ±5% 100mW; Supplier Part: C22369937; Manufacturer Part: RCA0310KJLF; Supplier Footprint: 0603; JLCPCB Part Class: Extended Part; Datasheet: https://item.szlcsc.com/datasheet/RCA0310KJLF/23848968.html; Supplier: LCSC; Convert to PCB: yes; Value: 10kΩ; Type: 厚膜电阻; FootprintName: R0603; DeviceName: RCA0310KJLF
R31 = RCA0310KJLF: Manufacturer: HKR(香港电阻); Symbol: 电阻; Add into BOM: yes; Tolerance: ±5%; Power(Watts): 100mW; Channel ID: $1e29266; Voltage-Supply(Max): 75V; Temperature Coefficient: ±100ppm/℃; Device: RCA0310KJLF; LCSC Part Name: 10kΩ ±5% 100mW; Supplier Part: C22369937; Manufacturer Part: RCA0310KJLF; Supplier Footprint: 0603; JLCPCB Part Class: Extended Part; Datasheet: https://item.szlcsc.com/datasheet/RCA0310KJLF/23848968.html; Supplier: LCSC; Convert to PCB: yes; Value: 10kΩ; Type: 厚膜电阻; FootprintName: R0603; DeviceName: RCA0310KJLF
R32 = RCA0310KJLF: Manufacturer: HKR(香港电阻); Symbol: 电阻; Add into BOM: yes; Tolerance: ±5%; Power(Watts): 100mW; Channel ID: $1e29290; Voltage-Supply(Max): 75V; Temperature Coefficient: ±100ppm/℃; Device: RCA0310KJLF; LCSC Part Name: 10kΩ ±5% 100mW; Supplier Part: C22369937; Manufacturer Part: RCA0310KJLF; Supplier Footprint: 0603; JLCPCB Part Class: Extended Part; Datasheet: https://item.szlcsc.com/datasheet/RCA0310KJLF/23848968.html; Supplier: LCSC; Convert to PCB: yes; Value: 10kΩ; Type: 厚膜电阻; FootprintName: R0603; DeviceName: RCA0310KJLF
R33 = RCA0310KJLF: Manufacturer: HKR(香港电阻); Symbol: 电阻; Add into BOM: yes; Tolerance: ±5%; Power(Watts): 100mW; Channel ID: $1e29485; Voltage-Supply(Max): 75V; Temperature Coefficient: ±100ppm/℃; Device: RCA0310KJLF; LCSC Part Name: 10kΩ ±5% 100mW; Supplier Part: C22369937; Manufacturer Part: RCA0310KJLF; Supplier Footprint: 0603; JLCPCB Part Class: Extended Part; Datasheet: https://item.szlcsc.com/datasheet/RCA0310KJLF/23848968.html; Supplier: LCSC; Convert to PCB: yes; Value: 10kΩ; Type: 厚膜电阻; FootprintName: R0603; DeviceName: RCA0310KJLF
R34 = RCA0310KJLF: Manufacturer: HKR(香港电阻); Symbol: 电阻; Add into BOM: yes; Tolerance: ±5%; Power(Watts): 100mW; Channel ID: $1e29509; Voltage-Supply(Max): 75V; Temperature Coefficient: ±100ppm/℃; Device: RCA0310KJLF; LCSC Part Name: 10kΩ ±5% 100mW; Supplier Part: C22369937; Manufacturer Part: RCA0310KJLF; Supplier Footprint: 0603; JLCPCB Part Class: Extended Part; Datasheet: https://item.szlcsc.com/datasheet/RCA0310KJLF/23848968.html; Supplier: LCSC; Convert to PCB: yes; Value: 10kΩ; Type: 厚膜电阻; FootprintName: R0603; DeviceName: RCA0310KJLF
Reset = KEY-3*4*2: Add into BOM: yes; Symbol: KEY-3*4*2; Device: KEY-3*4*2; LCSC Part Name: KEY-3*4*2; Supplier Part: C9900015662; Manufacturer Part: KEY-3*4*2; Supplier Footprint: KEY; JLCPCB Part Class: 扩展库; Supplier: LCSC; Convert to PCB: yes
typec = USB-TYPE-C-SMD6: Add into BOM: yes; Symbol: USB-TYPE-C-SMD6; Device: USB-TYPE-C-SMD6; LCSC Part Name: USB-TYPE-C-SMD6; Supplier Part: C9900008800; Manufacturer Part: USB-TYPE-C-SMD6; Supplier Footprint: TYPE-C_6Pin; JLCPCB Part Class: 扩展库; Supplier: LCSC; Convert to PCB: yes
U2 = TP4056_C21713961: Manufacturer: GOODWORK(固得沃克); Symbol: TP4056_C725790; Add into BOM: yes; The Chip Type: 线性充电芯片; Voltage - Supply: 4V~6.5V; Charge Current - Max: 1A; Charging Saturation Voltage: 4.2V; Type of Battery: 锂离子/聚合物; Number of Cells: 1; Battery Temperature Detection: 支持; Supply Current (Iq): 35uA; Channel ID: $1e1475; Device: TP4056_C21713961; LCSC Part Name: TP4056 1A 锂离子电池充电器; Supplier Part: C21713961; Manufacturer Part: TP4056; Supplier Footprint: ESOP-8; JLCPCB Part Class: Extended Part; Datasheet: https://item.szlcsc.com/datasheet/TP4056/23140154.html; Supplier: LCSC; Convert to PCB: yes; End-Off Voltage: -; Operating Temperature: -40℃~+85℃; 0V Battery Charge: 支持; FootprintName: ESOP-8_L4.9-W3.9-P1.27-LS6.0-BL-EP; DeviceName: TP4056_C21713961
U3 = STM32F103C8T6: Manufacturer: ST(意法半导体); Add into BOM: yes; CPU Core: ARM-M3; CPU Maximum Speed: 72MHz; Program Storage Size: 64KB; Program Memory Type: FLASH; Number of I/O: 37; ADC (Bit): 12bit; Voltage - Supply: 2V~3.6V; Symbol: STM32F103C8T6; Device: STM32F103C8T6; LCSC Part Name: 主流增强型ARM Cortex-M3 MCU，具有64 KB Flash、72 MHz CPU、电机控制、USB和CAN; Supplier Part: C8734; Manufacturer Part: STM32F103C8T6; Supplier Footprint: LQFP-48(7x7); JLCPCB Part Class: 扩展库; Datasheet: https://item.szlcsc.com/datasheet/STM32F103C8T6/9243.html; Supplier: LCSC; Convert to PCB: yes; Applications: -
U5 = AMS1117-3.3V_C5205141: Manufacturer: JSMSEMI(杰盛微); Add into BOM: yes; Output Type: 固定; Voltage - Supply: 15V; Output Voltage: 3.3V; Output Current: 1.2A; Voltage Dropout: 1.5V@(800mA); standby current: 5mA; Output Configuration: 正极; Power Supply Rejection Ratio (PSRR): 72dB@(120Hz); Number of Outputs: 1; Channel ID: $1e4021; Symbol: AMS1117-3.3; Device: AMS1117-3.3V_C5205141; LCSC Part Name: 输入18V 输出3.3V 800mA; Supplier Part: C5205141; Manufacturer Part: AMS1117-3.3V; Supplier Footprint: SOT-223; JLCPCB Part Class: Extended Part; Datasheet: https://atta.szlcsc.com/upload/public/pdf/source/20230807/E524BD9515A5B4B5F7AFDA5AFDCDAA11.pdf; Supplier: LCSC; Convert to PCB: yes; Features: 热关断; Operating Temperature: -20℃~+85℃; Noise: -; FootprintName: SOT-223-3_L6.5-W3.4-P2.30-LS7.0-BR; DeviceName: AMS1117-3.3V_C5205141
U6 = MPU-6500_C50278: Manufacturer: TDK InvenSense(应美盛); Symbol: MPU6500; Add into BOM: yes; Sensor Type: 加速度计陀螺仪; Device: MPU-6500_C50278; LCSC Part Name: MPU-6500; Supplier Part: C50278; Manufacturer Part: MPU-6500; Supplier Footprint: QFN-24-EP(3x3); JLCPCB Part Class: 扩展库; Datasheet: https://item.szlcsc.com/datasheet/MPU-6500/51287.html; Supplier: LCSC; Convert to PCB: yes; Operating Temperature: -40℃~+85℃
X1 = 8MHZ: Symbol: 8MHZ_C9900021358; Add into BOM: yes; Device: 8MHZ; LCSC Part Name: 8MHZ; Supplier Part: C9900021358; Manufacturer Part: 8MHZ; Supplier Footprint: X-HC49U直插; JLCPCB Part Class: 扩展库; Supplier: LCSC; Convert to PCB: yes
X2 = 32.768KHZ: Symbol: 32.768KHZ_C9900023773; Add into BOM: yes; Device: 32.768KHZ; LCSC Part Name: 32.768KHZ; Supplier Part: C9900023773; Manufacturer Part: 32.768KHZ; Supplier Footprint: FC-135; JLCPCB Part Class: 扩展库; Supplier: LCSC; Convert to PCB: yes